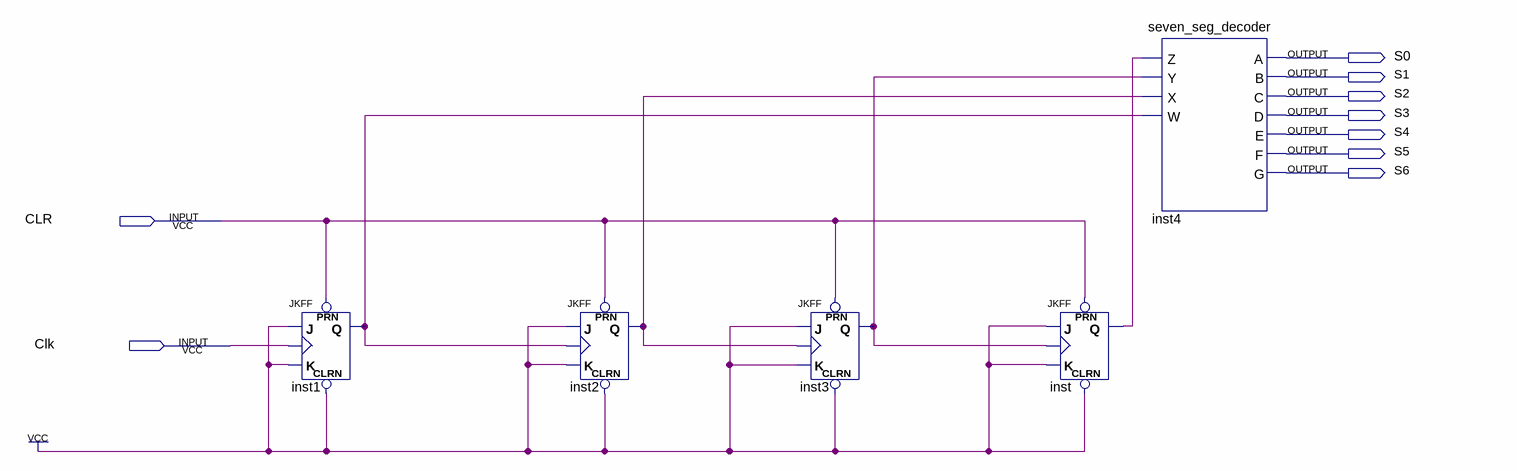
[diagram p0: schematic sheet]
// Quartus schematic lab10step3b.bdf as structural Verilog: 5 symbols, 9 pins
module lab10step3b (
  input  CLR,
  input  Clk,
  output S0,
  output S1,
  output S2,
  output S3,
  output S4,
  output S5,
  output S6
);

  wire inst1_q, inst2_q, inst3_q, inst_q;

  JKFF inst1 (.PRN(CLR), .CLRN(1'b1), .K(1'b1), .J(1'b1), .CLK(Clk), .Q(inst1_q));
  JKFF inst2 (.PRN(CLR), .CLRN(1'b1), .K(1'b1), .J(1'b1), .CLK(inst1_q), .Q(inst2_q));
  JKFF inst3 (.PRN(CLR), .CLRN(1'b1), .K(1'b1), .J(1'b1), .CLK(inst2_q), .Q(inst3_q));
  JKFF inst (.PRN(CLR), .CLRN(1'b1), .K(1'b1), .J(1'b1), .CLK(inst3_q), .Q(inst_q));
  seven_seg_decoder inst4 (
    .Z(inst_q), .Y(inst3_q), .X(inst2_q), .W(inst1_q), .A(S0), .B(S1), .C(S2), .D(S3), .E(S4), .F(S5), .G(S6));
endmodule
